# Altium schematic sheet Sheet1.SchDoc
size B
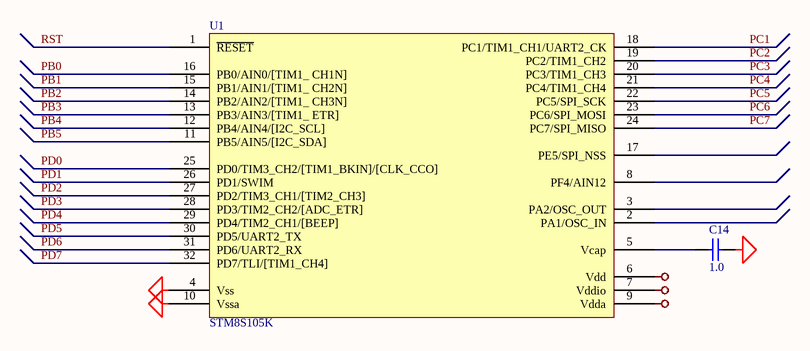
[diagram p0: Sheet1.SchDoc]

## Parts
C14  1.0  [_1206]
U1  STM8S105K  [QFP7X7-G32/X.5N]

## Nets
+5v: U1.6(Vdd) U1.7(Vddio) U1.9(Vdda)
GND: C14.1 U1.4(Vss) U1.10(Vssa)
PB0: U1.16(PB0/AIN0/[TIM1__CH1N])
PB1: U1.15(PB1/AIN1/[TIM1__CH2N])
PB2: U1.14(PB2/AIN2/[TIM1__CH3N])
PB3: U1.13(PB3/AIN3/[TIM1__ETR])
PB4: U1.12(PB4/AIN4/[I2C_SCL])
PB5: U1.11(PB5/AIN5/[I2C_SDA])
PC1: U1.18(PC1/TIM1_CH1/UART2_CK)
PC2: U1.19(PC2/TIM1_CH2)
PC3: U1.20(PC3/TIM1_CH3)
PC4: U1.21(PC4/TIM1_CH4)
PC5: U1.22(PC5/SPI_SCK)
PC6: U1.23(PC6/SPI_MOSI)
PC7: U1.24(PC7/SPI_MISO)
PD0: U1.25(PD0/TIM3_CH2/[TIM1_BKIN]/[CLK_CCO])
PD1: U1.26(PD1/SWIM)
PD2: U1.27(PD2/TIM3_CH1/[TIM2_CH3])
PD3: U1.28(PD3/TIM2_CH2/[ADC_ETR])
PD4: U1.29(PD4/TIM2_CH1/[BEEP])
PD5: U1.30(PD5/UART2_TX)
PD6: U1.31(PD6/UART2_RX)
PD7: U1.32(PD7/TLI/[TIM1_CH4])
RST: U1.1(~{RESET})
NetC14_2: C14.2 U1.5(Vcap)

Not connected (* = marked no-connect by the designer): U1 2(PA1/OSC_IN) 3(PA2/OSC_OUT) 8(PF4/AIN12) 17(PE5/SPI_NSS)

## Library data of the parts
C14 = Cap Semi: Capacitor; Manufacturer: Generic Components; Class I: Passive; Value: 0,1; Published: 8-Jun-2000; Revision: July-2002: Re-released for DXP Platform.; Publisher: Altium Limited; Class II: Capacitor